# Altium project Buck_Converter_OnurGnllu.PrjPcb
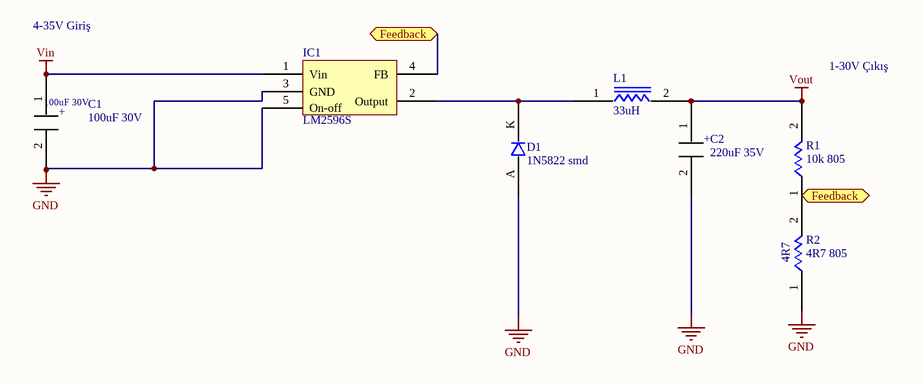
[diagram p0: buck_sch.SchDoc]
1 sheet, 7 parts. Net scope: flat (ports and power ports of the same name join across sheets).
Board file: buck_pcb_onur.PcbDoc

## Sheet buck_sch.SchDoc
size A4

### Parts
C1  100uF 30V  [100uF through hole]
C2  220uF 35V  [100uF through hole]
D1  1N5822 smd  [1N5822]
IC1  LM2596S  [LM2596]
L1  33uH  [33uH smd Inductor]
R1  10k 805  [805Res]
R2  4R7 805  [805Res]

### Ports
Feedback (bidir)

### Nets
GND: C1.2 C2.2 D1.A IC1.3(GND) IC1.5(On-off) R2.1
Vin: C1.1 IC1.1(Vin)
Vout: C2.1 L1.2 R1.2
NetD1_K: D1.K IC1.2(Output) L1.1
NetIC1_4: IC1.4(FB) R2.2 ; port Feedback

Not connected (* = marked no-connect by the designer): R1 1

### Notes on the sheet
- 4-35V Giriş
- 1-30V Çıkış
- (in symbol 4R7 805) 4R7
- (in symbol 100uF 30V) +
- (in symbol 220uF 35V) +

### Library data of the parts
R1 = Resistor 10k